# Altium schematic sheet POWERDoc.SchDoc
size A; SheetNumber: 6; SheetTotal: 6
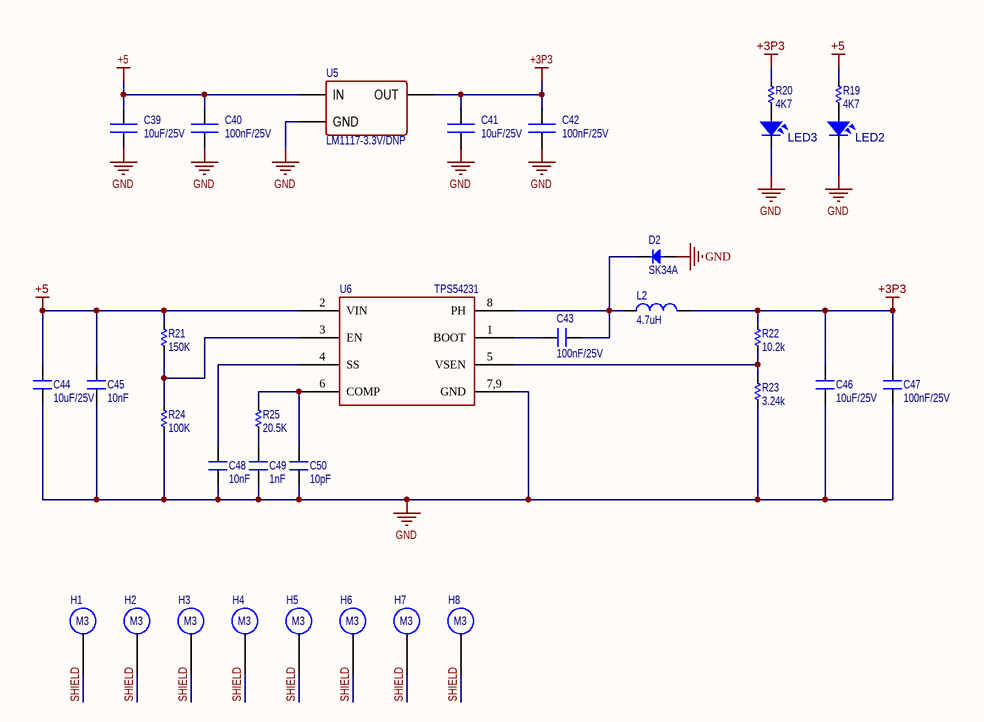
[diagram p0: POWERDoc.SchDoc]

## Parts
C39  10uF/25V  [CN-SMD-0603]
C40  100nF/25V  [CN-SMD-0603]
C41  10uF/25V  [CN-SMD-0603]
C42  100nF/25V  [CN-SMD-0603]
C43  100nF/25V  [CN-SMD-0603]
C44  10uF/25V  [CN-SMD-0603]
C45  10nF  [CN-SMD-0603]
C46  10uF/25V  [CN-SMD-0603]
C47  100nF/25V  [CN-SMD-0603]
C48  10nF  [CN-SMD-0603]
C49  1nF  [CN-SMD-0603]
C50  10pF  [CN-SMD-0603]
D2  SK34A  [DIO-SMD-A]
H1  M3  [M3]  (no BOM)
H2  M3  [M3]  (no BOM)
H3  M3  [M3]  (no BOM)
H4  M3  [M3]  (no BOM)
H5  M3  [M3]  (no BOM)
H6  M3  [M3]  (no BOM)
H7  M3  [M3]  (no BOM)
H8  M3  [M3]  (no BOM)
L2  4.7uH  [IND_AMDLA4020S-2R2MT]
LED2  LED  [LED-0603-RED]  (value not drawn)
LED3  LED  [LED-0603-RED]  (value not drawn)
R19  4K7  [RES-SMD-0603]
R20  4K7  [RES-SMD-0603]
R21  150K  [RES-SMD-0603]
R22  10.2k  [RES-SMD-0603]
R23  3.24k  [RES-SMD-0603]
R24  100K  [RES-SMD-0603]
R25  20.5K  [RES-SMD-0603]
U5  LM1117-3.3V/DNP  [SOT223]
U6  TPS54231  [HSOP8]

## Nets
+3P3: C41.2 C42.2 C46.2 C47.2 L2.2 R20.1 R22.1 U5.2,4(OUT)
+5: C39.2 C40.2 C44.2 C45.2 R19.1 R21.1 U5.3(IN) U6.2(VIN)
GND: C39.1 C40.1 C41.1 C42.1 C44.1 C45.1 C46.1 C47.1 C48.1 C49.1 C50.1 D2.1(A) LED2.2 LED3.2 R23.2 R24.2 U5.1(GND) U6.7,9(GND)
SHIELD: H1.1 H2.1 H3.1 H4.1 H5.1 H6.1 H7.1 H8.1
NetC43_1: C43.1 D2.2(K) L2.1 U6.8(PH)
NetC43_2: C43.2 U6.1(BOOT)
NetC48_2: C48.2 U6.4(SS)
NetC49_2: C49.2 R25.2
NetC50_2: C50.2 R25.1 U6.6(COMP)
NetLED2_1: LED2.1 R19.2
NetLED3_1: LED3.1 R20.2
NetR21_2: R21.2 R24.1 U6.3(EN)
NetR22_2: R22.2 R23.1 U6.5(VSEN)

## Library data of the parts
C39 C41 C44 C46 = CN: CAP CER 10UF 25V X5R 0603; PN: CL10A106MA8NRNC
C40 C42 C43 C47 = CN: CAP CER 0.1UF 25V X7R 0603; PN: CL10B104KA8NNNC
C45 C48 = CN: CAP CER 10000PF 50V X7R 0603; PN: CL10B103KB8NNNC
C49 = CN: CAP CER 0603 1NF 10V ULTRA STABL; PN: C0603C102J8HACAUTO
C50 = CN: CAP CER 10PF 50V C0G/NP0 0603; PN: C0603C100J5GACTU
D2 = Diode SMD: DIODE SCHOTTKY 40V 3A DO214AC; Code - JEDEC: DO-214-AB; Published: 8-Jun-2000; Revision: July-2002: Re-released for DXP Platform.; Publisher: Altium Limited; PN: SK34A
L2 = L-SMD-1: FIXED IND 4.7UH 3A 70 MOHM SMD; Manufacturer: Wurth Elektronik; PN: AMDLA4020S-4R7MT; Inductance: 1.0 μH; ComponentLink1Description: Manufacturer; ComponentLink1URL: http://www.we-online.de; Created by: Baojun Chen; Created Date: Nov.2015; ComponentLink2Description: Datasheet; ComponentLink2URL: http://katalog.we-online.de/pbs/datasheet/78477010.pdf
LED2 LED3 = LED SMD: LED RED CLEAR 0603 SMD; PN: 150060RS75000
R19 R20 = Res-SMD: RES SMD 4.7K OHM 1% 1/10W 0603; Manufacturer: Generic Components; PN: ERJ-3EKF4701V; Published: 08/06/2000; Publisher: Altium Hobart Technology Centre
R21 = Res-SMD: RES 150K OHM 1% 1/10W 0603; Manufacturer: Generic Components; PN: RMCF0603FT150K; Published: 08/06/2000; Publisher: Altium Hobart Technology Centre
R22 = Res-SMD: RES 10.2K OHM 1% 1/10W 0603; Manufacturer: Generic Components; PN: RC0603FR-0710K2L; Published: 08/06/2000; Publisher: Altium Hobart Technology Centre
R23 = Res-SMD: RES 3.24K OHM 1% 1/10W 0603; Manufacturer: Generic Components; PN: RMCF0603FT3K24; Published: 08/06/2000; Publisher: Altium Hobart Technology Centre
R24 = Res-SMD: RES 100K OHM 1% 1/10W 0603; Manufacturer: Generic Components; PN: RC0603FR-07100KL; Published: 08/06/2000; Publisher: Altium Hobart Technology Centre
R25 = Res-SMD: RES 20.5K OHM 1% 1/10W 0603; Manufacturer: Generic Components; PN: RC0603FR-0720K5L; Published: 08/06/2000; Publisher: Altium Hobart Technology Centre
U5 = LM1117: IC REG LIN 3.3V 800MA SOT-223-4; PN: TLV1117-33IDCYR; Website: http://group3i.net
U6 = TPS54231DR: TPS54231 2-A, 28-V Input, Step-Down DC-DC Converter With Eco-mode; PN: TPS54231DR